# Altium project OpenBCI Hyperscanning.PrjPcb
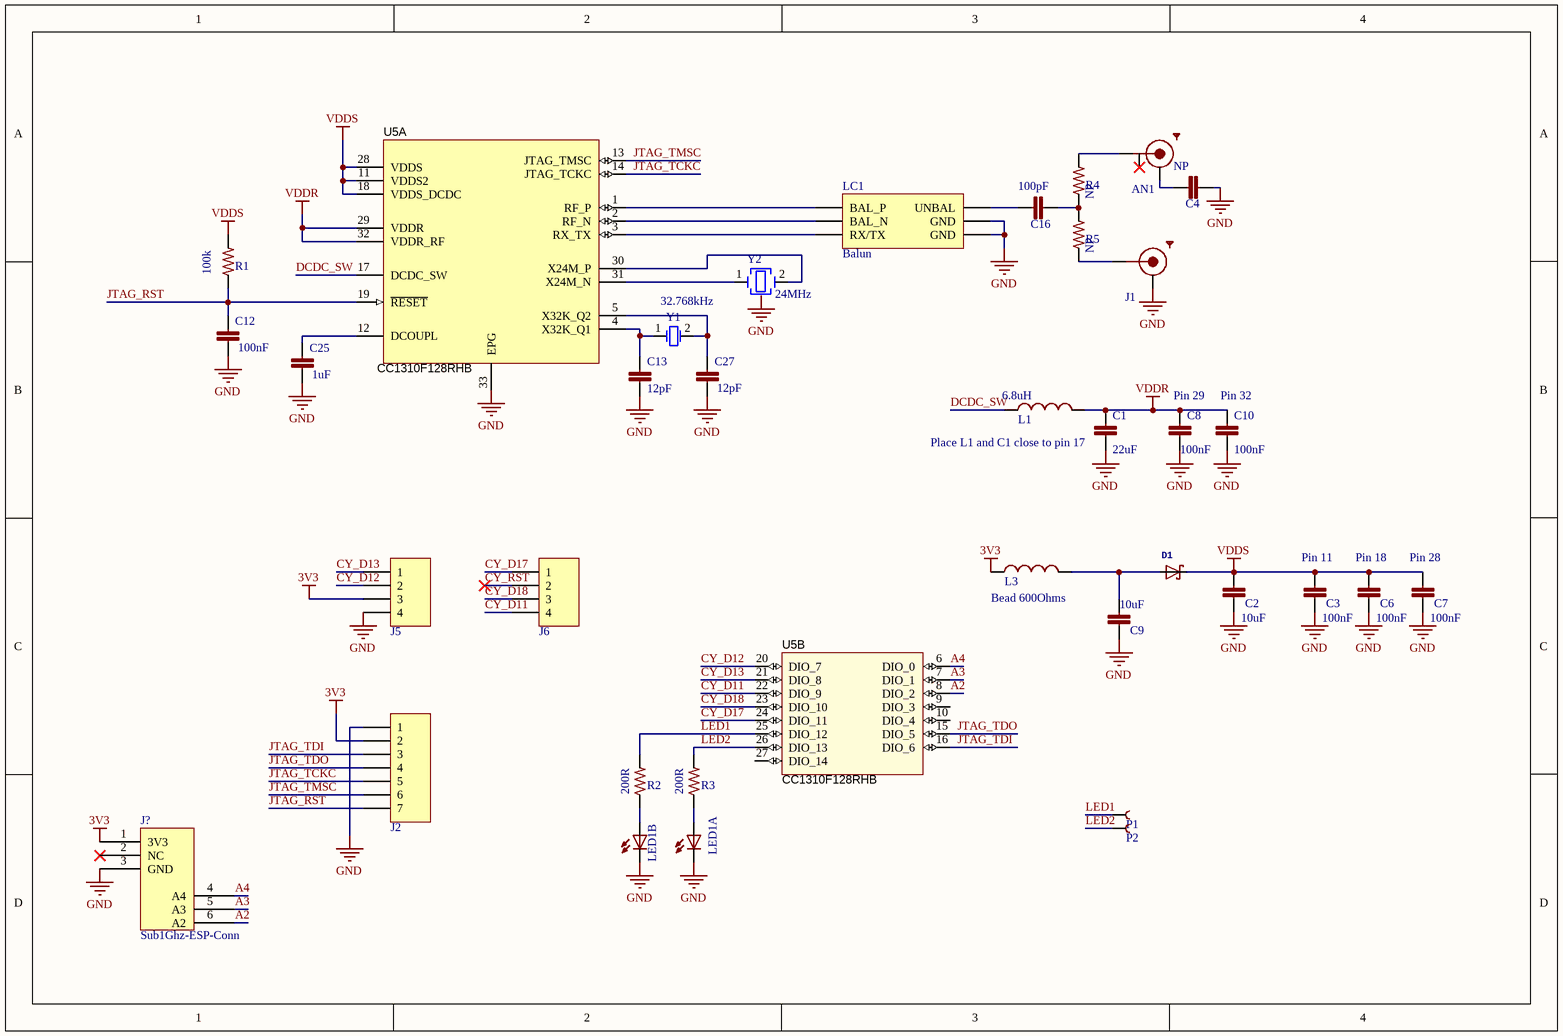
[diagram p0: CC1310.SchDoc]
1 sheet, 35 parts. Net scope: global (net labels, ports and power ports of the same name join across sheets).
Board file: OpenBCI Hyperscanning.PcbDoc

## Sheet CC1310.SchDoc: Prototipo Medidor Sem Fio
size A4; SheetNumber: 3

### Parts
AN1  Antenna Chip  [Antena_ethertronics_M620720]  (value not drawn)
C1  22uF  [C0603 - rounded]
C2  10uF  [C0603 - rounded]
C3  100nF  [C0402 - rounded]
C4  NP  [C0603 - rounded]
C6  100nF  [C0402 - rounded]
C7  100nF  [C0402 - rounded]
C8  100nF  [C0402 - rounded]
C9  10uF  [C0603 - rounded]
C10  100nF  [C0402 - rounded]
C12  100nF  [C0402 - rounded]
C13  12pF  [C0603 - rounded]
C16  100pF  [C0603 - rounded]
C25  1uF  [C0603 - rounded]
C27  12pF  [C0603 - rounded]
D1  Schottky Diode  [SOD523]  (value not drawn)
J1  U.FL PCB SMT  [U.FL MALE SMT]  (value not drawn)
J2  07p  [61300711121]  (value not drawn)
J5  04p  [61300411121]  (value not drawn)
J6  04p  [61300411121]  (value not drawn)
J?  Sub1Ghz-ESP-Conn  [Sub1GHz-ESP-Conn]
L1  value 6.8uH  [L0805]  (hidden comment: Ferrite bead 0603)
L3  value Bead 600Ohms  [L0603]  (hidden comment: Ferrite bead 0603)
LC1  Balun  [Balun_0603]
LED1  APTB1615SURKCGKC  [APTB1615SURKCGKC]  (value not drawn)  (parts A,B of 2)
P1  Single Pin Conn  [SinglePin]  (value not drawn)
P2  Single Pin Conn  [SinglePin]  (value not drawn)
R1  100k  [R0603 - rounded]
R2  200R  [R0603 - rounded]
R3  200R  [R0603 - rounded]
R4  NP  [R0402 - rounded]
R5  NP  [R0402 - rounded]
U5  CC1310F128RHB  [VQFN32-5x5]  (parts A,B of 2)
Y1  value 32.768kHz  [XTAL FC-135]  (hidden comment: XTAL_FC135)
Y2  value 24MHz  [XTAL TSX-3225]  (hidden comment: XTAL_TSX3225)

### Nets
3V3: J2.2 J5.3 J?.1(3V3) L3.1
GND: C1.2 C2.2 C3.2 C4.2 C6.2 C7.2 C8.2 C9.2 C10.2 C12.2 C13.2 C25.2 C27.2 J1.2(GND) J2.1 J5.4 J?.3(GND) LC1.5(GND) LC1.6(GND) LED1.C1 LED1.C2 U5.33(EPG) Y2.3(GND)
VDDR: C1.1 C8.1 C10.1 L1.2 U5.29(VDDR) U5.32(VDDR_RF)
VDDS: C2.1 C3.1 C6.1 C7.1 D1.C R1.2 U5.11(VDDS2) U5.18(VDDS_DCDC) U5.28(VDDS)
A2: J?.6(A2) U5.8(DIO_2)
A3: J?.5(A3) U5.7(DIO_1)
A4: J?.4(A4) U5.6(DIO_0)
CY_D11: J6.4 U5.22(DIO_9)
CY_D12: J5.2 U5.20(DIO_7)
CY_D13: J5.1 U5.21(DIO_8)
CY_D17: J6.1 U5.24(DIO_11)
CY_D18: J6.3 U5.23(DIO_10)
CY_RST: J6.2
DCDC_SW: L1.1 U5.17(DCDC_SW)
JTAG_RST: C12.1 J2.7 R1.1 U5.19(~{RESET})
JTAG_TCKC: J2.5 U5.14(JTAG_TCKC)
JTAG_TDI: J2.3 U5.16(DIO_6)
JTAG_TDO: J2.4 U5.15(DIO_5)
JTAG_TMSC: J2.6 U5.13(JTAG_TMSC)
LED1: P1.1 R2.2 U5.25(DIO_12)
LED2: P2.1 R3.2 U5.26(DIO_13)
NetAN1_1: AN1.1(FEED) R4.2
NetAN1_3: AN1.3(GND) C4.1
NetC9_1: C9.1 D1.A L3.2
NetC13_1: C13.1 U5.4(X32K_Q1) Y1.1(OSC1)
NetC16_1: C16.1 LC1.1(UNBAL)
NetC16_2: C16.2 R4.1 R5.2
NetC25_1: C25.1 U5.12(DCOUPL)
NetC27_1: C27.1 U5.5(X32K_Q2) Y1.2(OSC2)
NetJ1_1: J1.1(FEED) R5.1
NetLC1_2: LC1.2(RX/TX) U5.3(RX_TX)
NetLC1_3: LC1.3(BAL_N) U5.2(RF_N)
NetLC1_4: LC1.4(BAL_P) U5.1(RF_P)
NetLED1_A1: LED1.A1 R3.1
NetLED1_A2: LED1.A2 R2.1
NetU5_30: U5.30(X24M_P) Y2.2(OSC2)
NetU5_31: U5.31(X24M_N) Y2.1(OSC1)

Not connected (* = marked no-connect by the designer): AN1 2(DUMMY)*; J? 2(NC)*; U5 9(DIO_3) 10(DIO_4) 27(DIO_14)

### Notes on the sheet
- (near C1) Place L1 and C1 close to pin 17
- Pin 29
- (near C10) Pin 32
- (near C3) Pin 11
- (near C6) Pin 18
- (near C7) Pin 28

### Library data of the parts
AN1 = Antena_chip_Sub-1GHz_Kyocera: Antennas Ceramic Chip ANTENNA ISM Freq: 868 915MHz; Part Number: M620720; Vendor: AVX; Família: Antena; Value: Sub-1GHz
C1-C4 C6-C10 C12 C13 C16 C25 C27 = C-EU-SMD: Generic Capacitor SMD
  C1: Value: 22uF
  C2 C9: Value: 10uF
  C3 C6-C8 C10 C12: Value: 100nF
  C4: Value: NP
  C13 C27: Value: 12pF
  C16: Value: 100pF
  C25: Value: 1uF
D1 = SCHOTTKY-DIODEDO201T15: Part Number: PMEG2010AEB,115; Vendor: Nexperia; Familia: Diodos
J1 = U.FL PCB SMT: RF Connectors / Coaxial Connectors MHF1 Connector Receptacle, Male Pin 50 Ohm Surface Mount Solder; Part Number: 2337019-1; Value: NP; Vendor: TE Connectivity; Família: Antena
J2 = 61300711121: WR-PHD 2.54 mm THT Pin Header, 07p; Vendor: Wurth Elektronik; Part Number: 61300711121; Value: 07p
J5 J6 = 61300411121: WR-PHD 2.54 mm THT Pin Header, 04p; Vendor: Wurth Elektronik; Part Number: 61300411121; Value: 04p
L1 = L-US0805: Part Number: MLZ2012N6R8LTD25
L3 = L-US0603: Ferrite Beads 0603 600ohms; Part Number: MPZ1608S601ATA00; Vendor: Murata; Familia: Indutores
LC1 = Balun_CC1310: Sub-GHz Impedance Matched Balun + LPF integrated Passive Component for Texas Instruments CC1310 Chipset; Part Number: 0850BM14E0016 or LFB18868MBG9E212; Vendor: Johanson / Murata; Familia: Diversos
LED1 = APTB1615SURKCGKC: Vendor: Kingbright; Familia: LED_OPTO; Part Number: APTB1615SURKCGKC
R1 R4 R5 = R-US-SMD: Generic Resistor SMD
  R1: Value: 100k
  R4 R5: Value: NP
R2 R3 = R-US_R0603: Resistor SMD 0603; Value: 200R
U5 = CC1310F32RHB: Sub-1 GHz and 2.4 GHz Multi-standard RF IC Family, RSM; Vendor: TEXAS INSTRUMENTS; Familia: CI's; Part Number: CC1310F128RHB
Y1 = XTAL_FC135: CRYSTAL, RESONATOR, 32.768kHz, -20PPM/+20PPM, -40DEGC/+85DEGC, SMD; Part Number: FC-135 32.7680KA-AG0; Vendor: Epson; Familia: Diversos
Y2 = XTAL_TSX3225: CRYSTAL, CRYSTAL OSCILLATOR, 24MHz, -15PPM/DEGC/+15PPM/DEGC, -40DEGC/+85DEGC, SMD; Part Number: TSX-3225 24.0000MF15X-AC3; Vendor: Epson; Familia: Diversos